# Altium project PROC010B.PrjPcb (part 1 of 3)
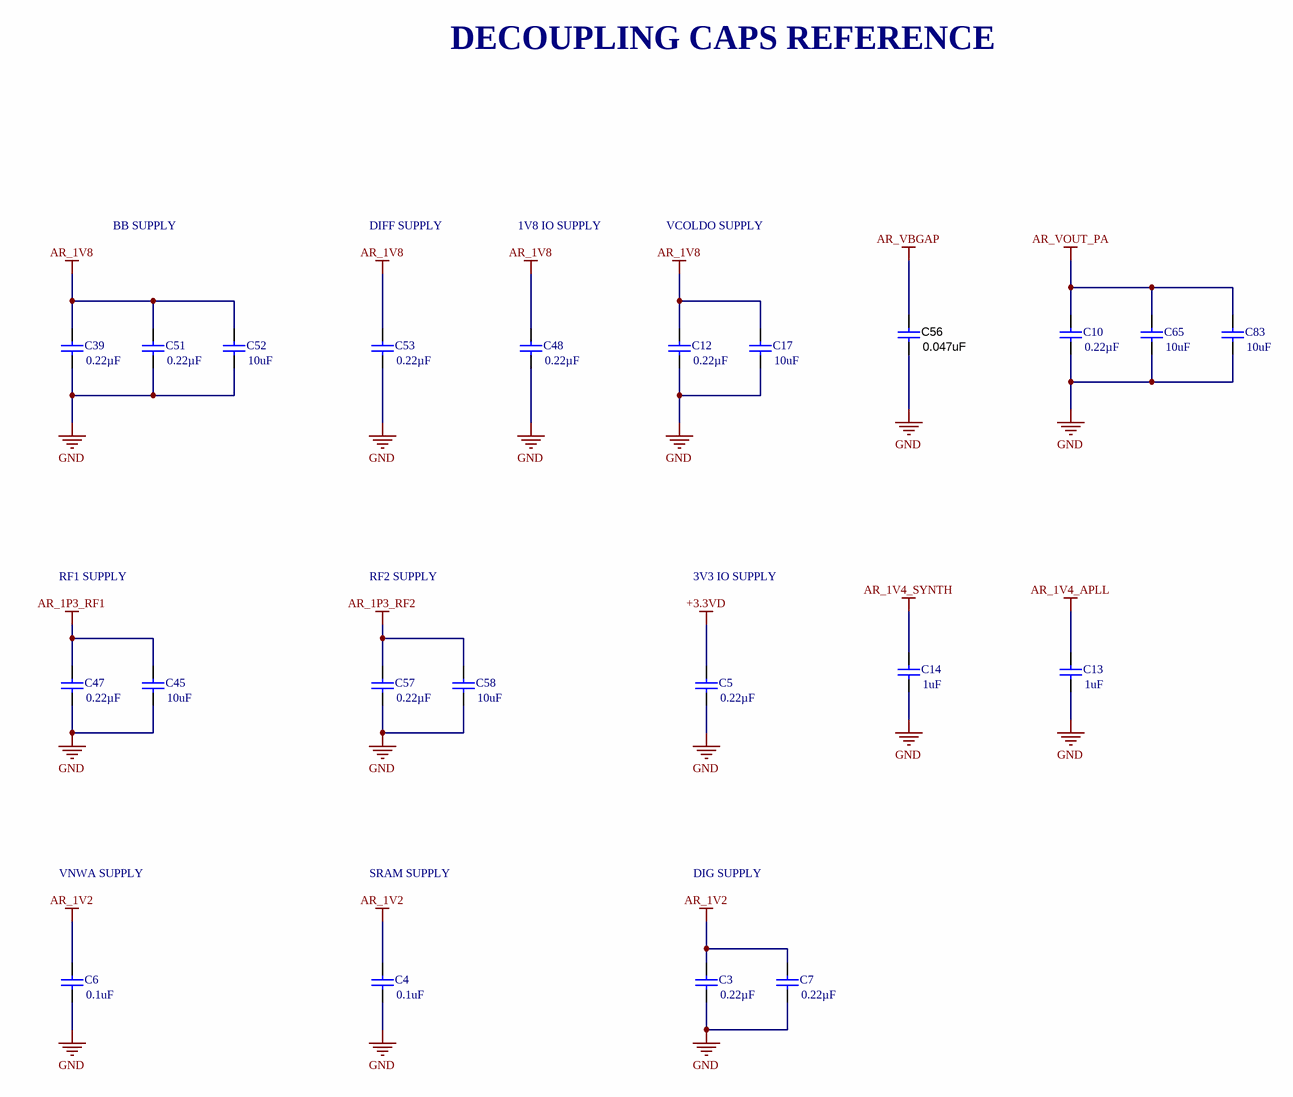
[diagram p0: PROC010C_Decoupling_Caps_Reference.SchDoc]
TID: N/A; TechSupport: http://www.ti.com/support; SCH_Rev: C; PRJ_Title: PROC010; PRJ_Number: PROC010; PRJ_Engineer: Adrian Ozer; PRJ_Customer: Public Release; PCB_Rev: B; PCB_Layout: Tessolve; CopyrightYear: 2018
7 sheets, 159 parts. Net scope: flat (ports and power ports of the same name join across sheets).
Board file: PROC010B_PCB.PcbDoc
Sheets:
  PROC010C_Decoupling_Caps_Reference.SchDoc
  PROC010C_LC_Filtering_Reference.SchDoc
  PROC010C_LP Connector.SchDoc
  PROC010C_XDS110 Interface_1A.SchDoc
  PROC010C_XDS110 Interface_1B.SchDoc
  PROC010C_CAN Interface.SchDoc
  PROC010C_Tempsensor.SchDoc

## Sheet PROC010C_Decoupling_Caps_Reference.SchDoc
size 431 x 279 mm; Date: Not shown in title block; ApprovedBy: Not shown in title block; CheckedBy: Not shown in title block; Author: Not shown in title block; CompanyName: Not shown in title block; DrawnBy: Adrian Ozer; Engineer: Not shown in title block; Organization: Not shown in title block; Address1: Not shown in title block; Address2: Not shown in title block; Address3: Not shown in title block; Address4: Not shown in title block; DocumentNumber: 3; Revision: Use project parameter SCH_Rev; SheetNumber: 3; SheetTotal: 16; PageSetup: Record=PageOptions|CenterHorizontal=True|CenterVertical=True|PrintScale=1.00|XCorrection=1.00|YCorrection=1.00|PrintKind=0|BorderSize=5000000|LeftOffset=0|BottomOffset=0|Orientation=2|PaperLength=1000|PaperWidth=1000|Scale=100|PaperSource=15|PrintQuality=600|MediaType=1|DitherType=10|PaperKind=Letter|PrintScaleMode=1; CurrentTime: Not shown in title block; CurrentDate: Not shown in title block; Time: Not shown in title block; DocumentFullPathAndName: Not shown in title block; DocumentName: Not shown in title block; ModifiedDate: Not shown in title block; ImagePath: Not shown in title block

### Parts
C3  ValueDisplayed: 0.22µF  [0402L]  (hidden comment: GCM155R71C224KE02D)
C4  ValueDisplayed: 0.1uF  [0402L]  (hidden comment: GCM155R71C104KA55D)
C5  ValueDisplayed: 0.22µF  [0402L]  (hidden comment: GCM155R71C224KE02D)
C6  ValueDisplayed: 0.1uF  [0402]  (hidden comment: GCM155R71C104KA55D)
C7  ValueDisplayed: 0.22µF  [0402L]  (hidden comment: GCM155R71C224KE02D)
C10  ValueDisplayed: 0.22µF  [0402]  (hidden comment: GCM155R71C224KE02D)
C12  ValueDisplayed: 0.22µF  [0402]  (hidden comment: GCM155R71C224KE02D)
C13  ValueDisplayed: 1uF  [0603]  (hidden comment: GCM188R71C105KA64D)
C14  ValueDisplayed: 1uF  [0603]  (hidden comment: GCM188R71C105KA64D)
C17  ValueDisplayed: 10uF  [0805_HV]  (hidden comment: GCM21BR71A106KE22L)
C39  ValueDisplayed: 0.22µF  [0402L]  (hidden comment: GCM155R71C224KE02D)
C45  ValueDisplayed: 10uF  [0805_HV1]  (hidden comment: GCM21BR71A106KE22L)
C47  ValueDisplayed: 0.22µF  [0402L]  (hidden comment: GCM155R71C224KE02D)
C48  ValueDisplayed: 0.22µF  [0402]  (hidden comment: GCM155R71C224KE02D)
C51  ValueDisplayed: 0.22µF  [0402]  (hidden comment: GCM155R71C224KE02D)
C52  ValueDisplayed: 10uF  [0805_HV]  (hidden comment: GCM21BR71A106KE22L)
C53  ValueDisplayed: 0.22µF  [0402]  (hidden comment: GCM155R71C224KE02D)
C56  ValueDisplayed: 0.047uF  [0402]  (hidden comment: CGA2B3X7R1H473K050BB)
C57  ValueDisplayed: 0.22µF  [0402]  (hidden comment: GCM155R71C224KE02D)
C58  ValueDisplayed: 10uF  [0805]  (hidden comment: GCM21BR71A106KE22L)
C65  ValueDisplayed: 10uF  [0805_HV]  (hidden comment: GCM21BR71A106KE22L)
C83  ValueDisplayed: 10uF  [0805_HV]  (hidden comment: GCM21BR71A106KE22L)

### Nets
+3.3VD: C5.1
AR_1P3_RF1: C45.1 C47.1
AR_1P3_RF2: C57.1 C58.1
AR_1V2: C3.1 C4.1 C6.1 C7.1
AR_1V4_APLL: C13.1
AR_1V4_SYNTH: C14.1
AR_1V8: C12.1 C17.1 C39.1 C48.1 C51.1 C52.1 C53.1
AR_VBGAP: C56.1
AR_VOUT_PA: C10.1 C65.1 C83.1
GND: C3.2 C4.2 C5.2 C6.2 C7.2 C10.2 C12.2 C13.2 C14.2 C17.2 C39.2 C45.2 C47.2 C48.2 C51.2 C52.2 C53.2 C56.2 C57.2 C58.2 C65.2 C83.2

### Notes on the sheet
- DECOUPLING CAPS REFERENCE
- BB SUPPLY
- DIFF SUPPLY
- 1V8 IO SUPPLY
- VCOLDO SUPPLY
- RF1 SUPPLY
- RF2 SUPPLY
- 3V3 IO SUPPLY
- VNWA SUPPLY
- SRAM SUPPLY
- DIG SUPPLY
- Drawn By:
- SVN Rev:
- Number:
- TID #:
- Orderable:
- Rev:
- Sheet Title:
- File:
- Project Title:
- Designed for:
- Assembly Variant:
- Mod. Date:
- Sheet:
- Size:
- of
- B
- http://www.ti.com
- Texas Instruments and/or its licensors do not warrant the accuracy or completeness of this specification or any information contained therein. Texas Instruments and/or its licensors do not warrant that this design will meet the specifications, will be suitable for your application or fit for any particular purpose, or will operate in an implementation. Texas Instruments and/or its licensors do not warrant that the design is production worthy. You should completely validate and test your design implementation to confirm the system functionality for your application.
- Engineer:
- Contact:
- © Texas Instruments

### Library data of the parts
C3 C5 C7 C39 C47 = CMP-0078265-1: CAP, CERM, 0.22 µF, 16 V,+/- 10%, X7R, AEC-Q200 Grade 1, 0402; Manufacturer: MuRata; TaMin_C: -55°C; Polarized: N; SizeAreaWB_mm2: 3; U/M: EA; Value: 0.22uF; TaMax_C: 125°C; SizeZ_mm: 0.6; SizeX_mm: 1; SizeY_mm: 0.5; Cap_Case: 0402; Value2: 16V; CompType: Capacitor; AEC Qualified: Y; Cap_F: 220nF; AEC Category: Q200; ComponentLink1URL: http://psearch.en.murata.com/capacitor/product/GCM155R71C224KE02%23.pdf; Supplier Part Number 2: 81-GCM155R71C224KE2D; Supplier 2: Mouser; TempCo: X7R; RoHS: Y; MountType: SMT; Supplier 1: Digi-Key; PackageReference: 0402; Tolerance_%: 10%; SizeArea_mm2: 0.5; PartNumber: GCM155R71C224KE02D; VDC_V: 16V; ComponentLink1Description: Datasheet link; AEC Grade: 1; Supplier Part Number 1: 490-10671-1-ND; Technology: Ceramic
C4 = CMP-0006351-2: CAP, CERM, 0.1 uF, 16 V, +/- 10%, X7R, 0402; Manufacturer: MuRata; TaMin_C: -55°C; Polarized: N; SizeAreaWB_mm2: 3; Value1: Unknown; U/M: EA; Value: 0.1uF; TaMax_C: 125°C; SizeZ_mm: 0.6; SizeX_mm: 1; SizeY_mm: 0.5; Cap_Case: 0402; Value2: 16V; CompType: Capacitor; Cap_F: 100nF; AEC Category: Q200; Publisher: Texas Instruments; TempCo: X7R; Published: 2008-06-19; RoHS: Y; MountType: SMT; Supplier 1: Digi-Key; PackageReference: 0402; Tolerance_%: 10%; SizeArea_mm2: 0.5; LatestRevisionDate: 2017-03-09; PartNumber: GCM155R71C104KA55D; AEC Qualified: ?; VDC_V: 16V; ComponentLink1Description: Datasheet link; Supplier Part Number 1: 490-4759-2-ND; Technology: Ceramic; ComponentLink1URL: http://psearch.murata.com/capacitor/product/GCM155R71C104KA55%23.pdf
C6 = CMP-0006351-2: CAP, CERM, 0.1 uF, 16 V, +/- 10%, X7R, 0402; Manufacturer: MuRata; TaMin_C: -55°C; Polarized: N; SizeAreaWB_mm2: 3; Value1: Unknown; U/M: EA; Value: 0.1uF; TaMax_C: 125°C; SizeZ_mm: 0.6; SizeX_mm: 1; SizeY_mm: 0.5; Value2: 16V; Cap_F: 100nF; AEC Category: Q200; Publisher: Texas Instruments; TempCo: X7R; Published: 2008-06-19; RoHS: Y; MountType: SMT; Supplier 1: Digi-Key; PackageReference: 0402; Tolerance_%: 10%; Cap_Case: 0402; SizeArea_mm2: 0.5; CompType: Capacitor; LatestRevisionDate: 2017-03-09; PartNumber: GCM155R71C104KA55D; AEC Qualified: ?; VDC_V: 16V; ComponentLink1Description: Datasheet link; Supplier Part Number 1: 490-4759-2-ND; Technology: Ceramic; ComponentLink1URL: http://psearch.murata.com/capacitor/product/GCM155R71C104KA55%23.pdf
C10 C12 C48 C51 C53 C57 = CMP-0078265-1: CAP, CERM, 0.22 µF, 16 V,+/- 10%, X7R, AEC-Q200 Grade 1, 0402; Manufacturer: MuRata; TaMin_C: -55°C; Polarized: N; SizeAreaWB_mm2: 3; U/M: EA; Value: 0.22uF; TaMax_C: 125°C; SizeZ_mm: 0.6; SizeX_mm: 1; SizeY_mm: 0.5; Value2: 16V; AEC Qualified: Y; Cap_F: 220nF; AEC Category: Q200; ComponentLink1URL: http://psearch.en.murata.com/capacitor/product/GCM155R71C224KE02%23.pdf; Supplier Part Number 2: 81-GCM155R71C224KE2D; Supplier 2: Mouser; TempCo: X7R; RoHS: Y; MountType: SMT; Supplier 1: Digi-Key; PackageReference: 0402; Tolerance_%: 10%; Cap_Case: 0402; SizeArea_mm2: 0.5; CompType: Capacitor; PartNumber: GCM155R71C224KE02D; VDC_V: 16V; ComponentLink1Description: Datasheet link; AEC Grade: 1; Supplier Part Number 1: 490-10671-1-ND; Technology: Ceramic
C13 C14 = CMP-0007136-5: CAP, CERM, 1 uF, 16 V, +/- 10%, X7R, AEC-Q200 Grade 1, 0603; Manufacturer: MuRata; TaMin_C: -55°C; Polarized: N; SizeAreaWB_mm2: 4.68; Value1: Unknown; U/M: EA; Value: 1uF; TaMax_C: 125°C; SizeZ_mm: 1; SizeX_mm: 1.6; SizeY_mm: 0.8; Value2: 16V; SizeArea_mm2: 1.28; AEC Qualified: Y; Cap_F: 1µF; AEC Category: Q200; Supplier Part Number 2: 81-GCM188R71C105K64D; Publisher: Texas Instruments; Supplier 2: Mouser; TempCo: X7R; Published: 2008-06-19; RoHS: Y; MountType: SMT; Supplier 1: Digi-Key; PackageReference: 0603; Tolerance_%: 10%; Cap_Case: 0603; CompType: Capacitor; LatestRevisionDate: 2017-03-09; PartNumber: GCM188R71C105KA64D; VDC_V: 16V; ComponentLink1Description: Datasheet link; AEC Grade: 1; Supplier Part Number 1: 490-5241-6-ND; Technology: Ceramic; ComponentLink1URL: http://psearch.en.murata.com/capacitor/product/GCM188R71C105KA64%23.pdf
C17 C52 C65 C83 = CMP-0008017-2: CAP, CERM, 10 uF, 10 V, +/- 10%, X7R, 0805; Manufacturer: MuRata; TaMin_C: -55°C; Polarized: N; SizeAreaWB_mm2: 6.75; Value1: Unknown; U/M: EA; Value: 10uF; TaMax_C: 125°C; SizeZ_mm: 1.45; SizeX_mm: 2; SizeY_mm: 1.25; Cap_Case: 0805; Value2: 10V; SizeArea_mm2: 2.5; Cap_F: 10µF; AEC Category: Q200; Supplier Part Number 2: 06AC6014; Publisher: Texas Instruments; Supplier 2: Newark; Supplier Part Number 3: 81-GCM21BR71A106KE2L; TempCo: X7R; Supplier 3: Mouser; Published: 2008-06-19; RoHS: Y; MountType: SMT; Supplier 1: Digi-Key; PackageReference: 0805; Tolerance_%: 10%; CompType: Capacitor; LatestRevisionDate: 2017-03-09; PartNumber: GCM21BR71A106KE22L; AEC Qualified: ?; VDC_V: 10V; ComponentLink1Description: Datasheet link; Supplier Part Number 1: 490-10674-1-ND; Technology: Ceramic; ComponentLink1URL: http://www.murata.com/products/catalog/pdf/c03e.pdf
C45 = CMP-0008017-2: CAP, CERM, 10 uF, 10 V, +/- 10%, X7R, 0805; Manufacturer: MuRata; TaMin_C: -55°C; Polarized: N; SizeAreaWB_mm2: 6.75; Value1: Unknown; U/M: EA; Value: 10uF; TaMax_C: 125°C; SizeZ_mm: 1.45; SizeX_mm: 2; SizeY_mm: 1.25; Cap_Case: 0805; Value2: 10V; SizeArea_mm2: 2.5; CompType: Capacitor; Cap_F: 10µF; AEC Category: Q200; Supplier Part Number 2: 06AC6014; Publisher: Texas Instruments; Supplier 2: Newark; Supplier Part Number 3: 81-GCM21BR71A106KE2L; TempCo: X7R; Supplier 3: Mouser; Published: 2008-06-19; RoHS: Y; MountType: SMT; Supplier 1: Digi-Key; PackageReference: 0805; Tolerance_%: 10%; LatestRevisionDate: 2017-03-09; PartNumber: GCM21BR71A106KE22L; AEC Qualified: ?; VDC_V: 10V; ComponentLink1Description: Datasheet link; Supplier Part Number 1: 490-10674-1-ND; Technology: Ceramic; ComponentLink1URL: http://www.murata.com/products/catalog/pdf/c03e.pdf
C56 = CMP-0006330-2: CAP, CERM, 0.047 uF, 50 V, +/- 10%, X7R, AEC-Q200 Grade 1, 0402; Manufacturer: TDK; TaMin_C: -55°C; ESR_ohm: 0.06407; Polarized: N; SizeAreaWB_mm2: 3; Value1: 0.06407 ohm; U/M: EA; TaMax_C: 125°C; SizeZ_mm: 0.6; SizeX_mm: 1; SizeY_mm: 0.5; Value2: 50V; AEC Qualified: Y; Cap_F: 47nF; IRMS_A: 646.122mA; AEC Category: Q200; Supplier Part Number 2: 810-CGA2B3X7R1H473K050BB; Publisher: Texas Instruments; Supplier 2: Mouser; TempCo: X7R; Published: 2008-06-19; RoHS: Y; MountType: SMT; Value: 0.047uF; Supplier 1: Digi-Key; PackageReference: 0402; Tolerance_%: 10%; Cap_Case: 0402; SizeArea_mm2: 0.5; CompType: Capacitor; LatestRevisionDate: 2017-03-09; PartNumber: CGA2B3X7R1H473K050BB; VDC_V: 50V; ComponentLink1Description: Datasheet link; AEC Grade: 1; Supplier Part Number 1: 445-6897-1-ND; Technology: Ceramic; ComponentLink1URL: https://product.tdk.com/en/search/capacitor/ceramic/mlcc/info?part_no=CGA2B3X7R1H473K050BB
C58 = CMP-0008017-2: CAP, CERM, 10 uF, 10 V, +/- 10%, X7R, 0805; Manufacturer: MuRata; TaMin_C: -55°C; Polarized: N; SizeAreaWB_mm2: 6.75; Value1: Unknown; U/M: EA; Value: 10uF; TaMax_C: 125°C; SizeZ_mm: 1.45; SizeX_mm: 2; SizeY_mm: 1.25; Value2: 10V; SizeArea_mm2: 2.5; CompType: Capacitor; Cap_F: 10µF; AEC Category: Q200; Supplier Part Number 2: 06AC6014; Publisher: Texas Instruments; Supplier 2: Newark; Supplier Part Number 3: 81-GCM21BR71A106KE2L; TempCo: X7R; Supplier 3: Mouser; Published: 2008-06-19; RoHS: Y; MountType: SMT; Supplier 1: Digi-Key; PackageReference: 0805; Tolerance_%: 10%; Cap_Case: 0805; LatestRevisionDate: 2017-03-09; PartNumber: GCM21BR71A106KE22L; AEC Qualified: ?; VDC_V: 10V; ComponentLink1Description: Datasheet link; Supplier Part Number 1: 490-10674-1-ND; Technology: Ceramic; ComponentLink1URL: http://www.murata.com/products/catalog/pdf/c03e.pdf

## Sheet PROC010C_LC_Filtering_Reference.SchDoc
size 431 x 279 mm; Date: Not shown in title block; ApprovedBy: Not shown in title block; CheckedBy: Not shown in title block; Author: Not shown in title block; CompanyName: Not shown in title block; DrawnBy: Adrian Ozer; Engineer: Not shown in title block; Organization: Not shown in title block; Address1: Not shown in title block; Address2: Not shown in title block; Address3: Not shown in title block; Address4: Not shown in title block; DocumentNumber: 5; Revision: Use project parameter SCH_Rev; SheetNumber: 5; SheetTotal: 16; PageSetup: Record=PageOptions|CenterHorizontal=True|CenterVertical=True|PrintScale=1.00|XCorrection=1.00|YCorrection=1.00|PrintKind=0|BorderSize=5000000|LeftOffset=0|BottomOffset=0|Orientation=2|PaperLength=1000|PaperWidth=1000|Scale=100|PaperSource=15|PrintQuality=600|MediaType=1|DitherType=10|PaperKind=Letter|PrintScaleMode=1; CurrentTime: Not shown in title block; CurrentDate: Not shown in title block; Time: Not shown in title block; DocumentFullPathAndName: Not shown in title block; DocumentName: Not shown in title block; ModifiedDate: Not shown in title block; ImagePath: Not shown in title block
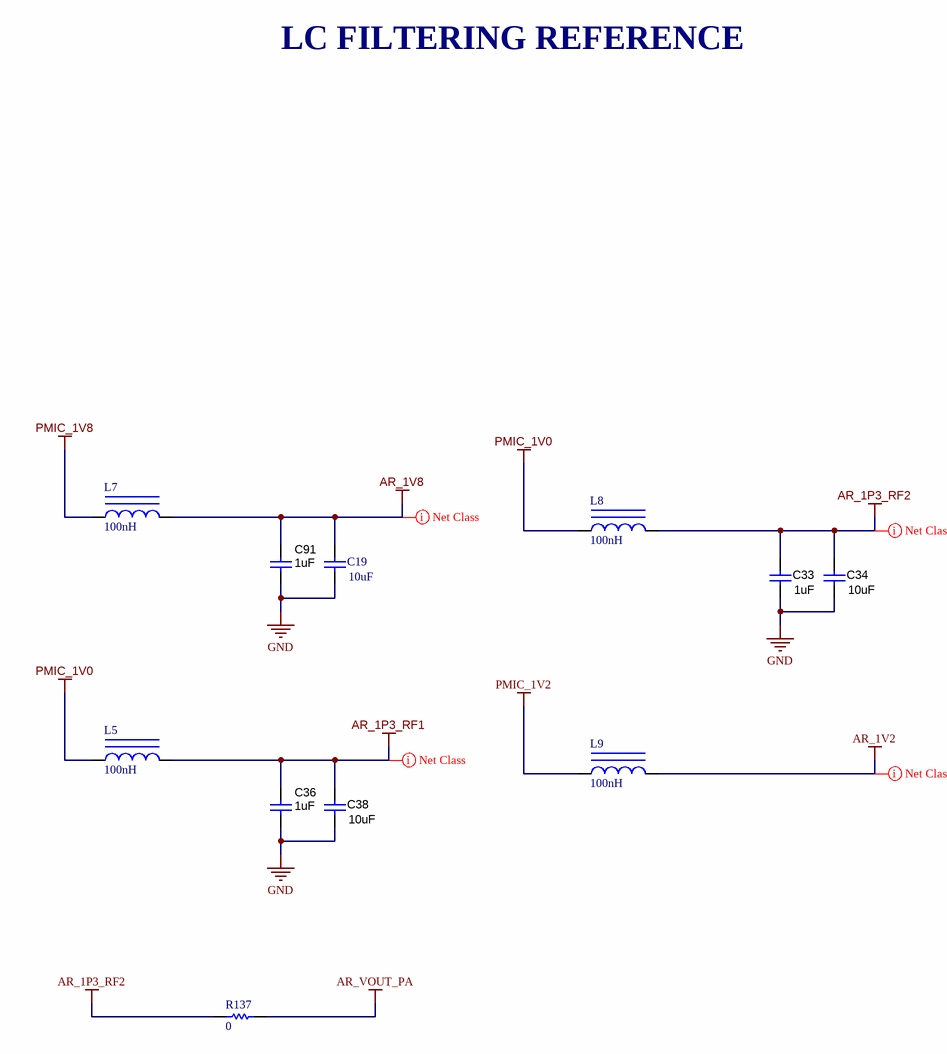
[diagram p1: PROC010C_LC_Filtering_Reference.SchDoc]

### Parts
C19  ValueDisplayed: 10uF  [0805_HV]  (hidden comment: GCM21BR71A106KE22L)
C33  ValueDisplayed: 1uF  [0603]  (hidden comment: GCM188R71C105KA64D)
C34  ValueDisplayed: 10uF  [0805_HV]  (hidden comment: GCM21BR71A106KE22L)
C36  ValueDisplayed: 1uF  [0603]  (hidden comment: GCM188R71C105KA64D)
C38  ValueDisplayed: 10uF  [0805_HV]  (hidden comment: GCM21BR71A106KE22L)
C91  ValueDisplayed: 1uF  [0603]  (hidden comment: GCM188R71C105KA64D)
L5  ValueDisplayed: 100nH  [NLCV32]  (hidden comment: NLCV32T-R10M-EFRD)
L7  ValueDisplayed: 100nH  [NLCV32]  (hidden comment: NLCV32T-R10M-EFRD)
L8  ValueDisplayed: 100nH  [NLCV32]  (hidden comment: NLCV32T-R10M-EFRD)
L9  ValueDisplayed: 100nH  [NLCV32]  (hidden comment: NLCV32T-R10M-EFRD)
R137  ValueDisplayed: 0  [0603]  (hidden comment: MCT06030Z0000ZP500)

### Nets
AR_1P3_RF1: C36.2 C38.2 L5.2
AR_1P3_RF2: C33.2 C34.2 L8.2 R137.1
AR_1V2: L9.2
AR_1V8: C19.1 C91.2 L7.2
AR_VOUT_PA: R137.2
GND: C19.2 C33.1 C34.1 C36.1 C38.1 C91.1
PMIC_1V0: L5.1 L8.1
PMIC_1V2: L9.1
PMIC_1V8: L7.1

### Layout directives
net class PWR: AR_1P3_RF1, AR_1P3_RF2, AR_1V2, AR_1V8

### Notes on the sheet
- LC FILTERING REFERENCE
- Drawn By:
- SVN Rev:
- Number:
- TID #:
- Orderable:
- Rev:
- Sheet Title:
- File:
- Project Title:
- Designed for:
- Assembly Variant:
- Mod. Date:
- Sheet:
- Size:
- of
- B
- http://www.ti.com
- Texas Instruments and/or its licensors do not warrant the accuracy or completeness of this specification or any information contained therein. Texas Instruments and/or its licensors do not warrant that this design will meet the specifications, will be suitable for your application or fit for any particular purpose, or will operate in an implementation. Texas Instruments and/or its licensors do not warrant that the design is production worthy. You should completely validate and test your design implementation to confirm the system functionality for your application.
- Engineer:
- Contact:
- © Texas Instruments

### Library data of the parts
C19 = CMP-0008017-2: as C17 on sheet PROC010C_Decoupling_Caps_Reference; Supplier Part Number 2: 06AC6014; Publisher: Texas Instruments; Supplier 2: Newark; Supplier Part Number 3: 81-GCM21BR71A106KE2L; TempCo: X7R; Supplier 3: Mouser; Published: 2008-06-19; RoHS: Y; MountType: SMT; Supplier 1: Digi-Key; PackageReference: 0805; Tolerance_%: 10%; CompType: Capacitor; LatestRevisionDate: 2017-03-09; PartNumber: GCM21BR71A106KE22L; AEC Qualified: ?; VDC_V: 10V; ComponentLink1Description: Datasheet link; Supplier Part Number 1: 490-10674-1-ND; Technology: Ceramic; ComponentLink1URL: http://www.murata.com/products/catalog/pdf/c03e.pdf
C33 C36 C91 = CMP-0007136-5: as C13 on sheet PROC010C_Decoupling_Caps_Reference; Supplier Part Number 2: 81-GCM188R71C105K64D; Publisher: Texas Instruments; Supplier 2: Mouser; TempCo: X7R; Published: 2008-06-19; RoHS: Y; MountType: SMT; Supplier 1: Digi-Key; PackageReference: 0603; Tolerance_%: 10%; Cap_Case: 0603; CompType: Capacitor; LatestRevisionDate: 2017-03-09; PartNumber: GCM188R71C105KA64D; VDC_V: 16V; ComponentLink1Description: Datasheet link; AEC Grade: 1; Supplier Part Number 1: 490-5241-6-ND; Technology: Ceramic; ComponentLink1URL: http://psearch.en.murata.com/capacitor/product/GCM188R71C105KA64%23.pdf
C34 C38 = CMP-0008017-2: as C45 on sheet PROC010C_Decoupling_Caps_Reference; Supplier Part Number 2: 06AC6014; Publisher: Texas Instruments; Supplier 2: Newark; Supplier Part Number 3: 81-GCM21BR71A106KE2L; TempCo: X7R; Supplier 3: Mouser; Published: 2008-06-19; RoHS: Y; MountType: SMT; Supplier 1: Digi-Key; PackageReference: 0805; Tolerance_%: 10%; LatestRevisionDate: 2017-03-09; PartNumber: GCM21BR71A106KE22L; AEC Qualified: ?; VDC_V: 10V; ComponentLink1Description: Datasheet link; Supplier Part Number 1: 490-10674-1-ND; Technology: Ceramic; ComponentLink1URL: http://www.murata.com/products/catalog/pdf/c03e.pdf
L5 L7-L9 = CMP-0083745-1: Inductor, Wirewound, Ferrite, 100 nH, 2.85 A, 0.024 ohm, AEC-Q200 Grade 1, SMD; Manufacturer: TDK; Isat: 2.85A @ 10% inductance drop; Irms: 2.85A @ 40C rise; SizeAreaWB_mm2: 13.44; DCR_ohm: 0.024; Value: 100nH; Imax_A: 2.85A; SizeZ_mm: 2.5; SizeX_mm: 3.2; SizeY_mm: 2.2; SizeArea_mm2: 7.04; AEC Qualified: Y; AEC Grade: 1; AEC Category: Q200; ComponentLink1URL: https://product.tdk.com/info/en/catalog/datasheets/inductor_automotive_decoupling_nlcv32-efrd_en.pdf; RoHS: Y; Value1: 0.024 ohm; Material: Ferrite; MountType: SMT; PackageReference: 3.2x2.2x2.5mm; Value2: 2.85A; CompType: Inductor; Ind_H: 100nH; PartNumber: NLCV32T-R10M-EFRD; ComponentLink1Description: Datasheet link; Technology: Wirewound
R137 = CMP-0025884-3: RES, 0, 5%, 0.125 W, 0603; Manufacturer: Vishay/Beyschlag; Power_W: 125mW; TempCo: ppm/C; Value_Code: 0000; U/M: EA; Value: 0; EIA_Code: E24; SizeX_mm: 1.6; SizeY_mm: 0.8; SizeZ_mm: 1; Value2: 0.125W; SizeArea_mm2: 1.28; CompType: Resistor; AEC Qualified: N; AEC Category: Q200; Supplier Part Number 2: 96Y9454; Publisher: Texas Instruments; Supplier 2: Newark; Supplier Part Number 3: 594-MCT06030Z0000ZP5; Supplier 3: Mouser; Published: 2008-06-26; RoHS: Y; Value1: 5%; MountType: SMT; Supplier 1: Digi-Key; PackageReference: 0603; Tolerance_%: 5%; Res_ohm: 0; LatestRevisionDate: 2017-03-09; PartNumber: MCT06030Z0000ZP500; ComponentLink1Description: Datasheet link; AEC Grade: N/A; Supplier Part Number 1: MCT0603-0.0-ZZCT-ND; Technology: Thin Film; ComponentLink1URL: http://www.vishay.com/docs/28705/mcx0x0xpro.pdf

## Sheet PROC010C_LP Connector.SchDoc: LP Connector
size 431 x 279 mm; Date: Not shown in title block; ApprovedBy: Not shown in title block; CheckedBy: Not shown in title block; Author: Not shown in title block; CompanyName: Not shown in title block; DrawnBy: Adrian Ozer; Engineer: Not shown in title block; Organization: Not shown in title block; Address1: Not shown in title block; Address2: Not shown in title block; Address3: Not shown in title block; Address4: Not shown in title block; DocumentNumber: 11; Revision: Use project parameter SCH_Rev; SheetNumber: 11; SheetTotal: 16; PageSetup: Record=PageOptions|CenterHorizontal=True|CenterVertical=True|PrintScale=1.00|XCorrection=1.00|YCorrection=1.00|PrintKind=0|BorderSize=5000000|LeftOffset=0|BottomOffset=0|Orientation=2|PaperLength=1000|PaperWidth=1000|Scale=100|PaperSource=15|PrintQuality=600|MediaType=1|DitherType=10|PaperKind=Letter|PrintScaleMode=1; CurrentTime: Not shown in title block; CurrentDate: Not shown in title block; Time: Not shown in title block; DocumentFullPathAndName: Not shown in title block; DocumentName: Not shown in title block; ModifiedDate: Not shown in title block; ImagePath: Not shown in title block
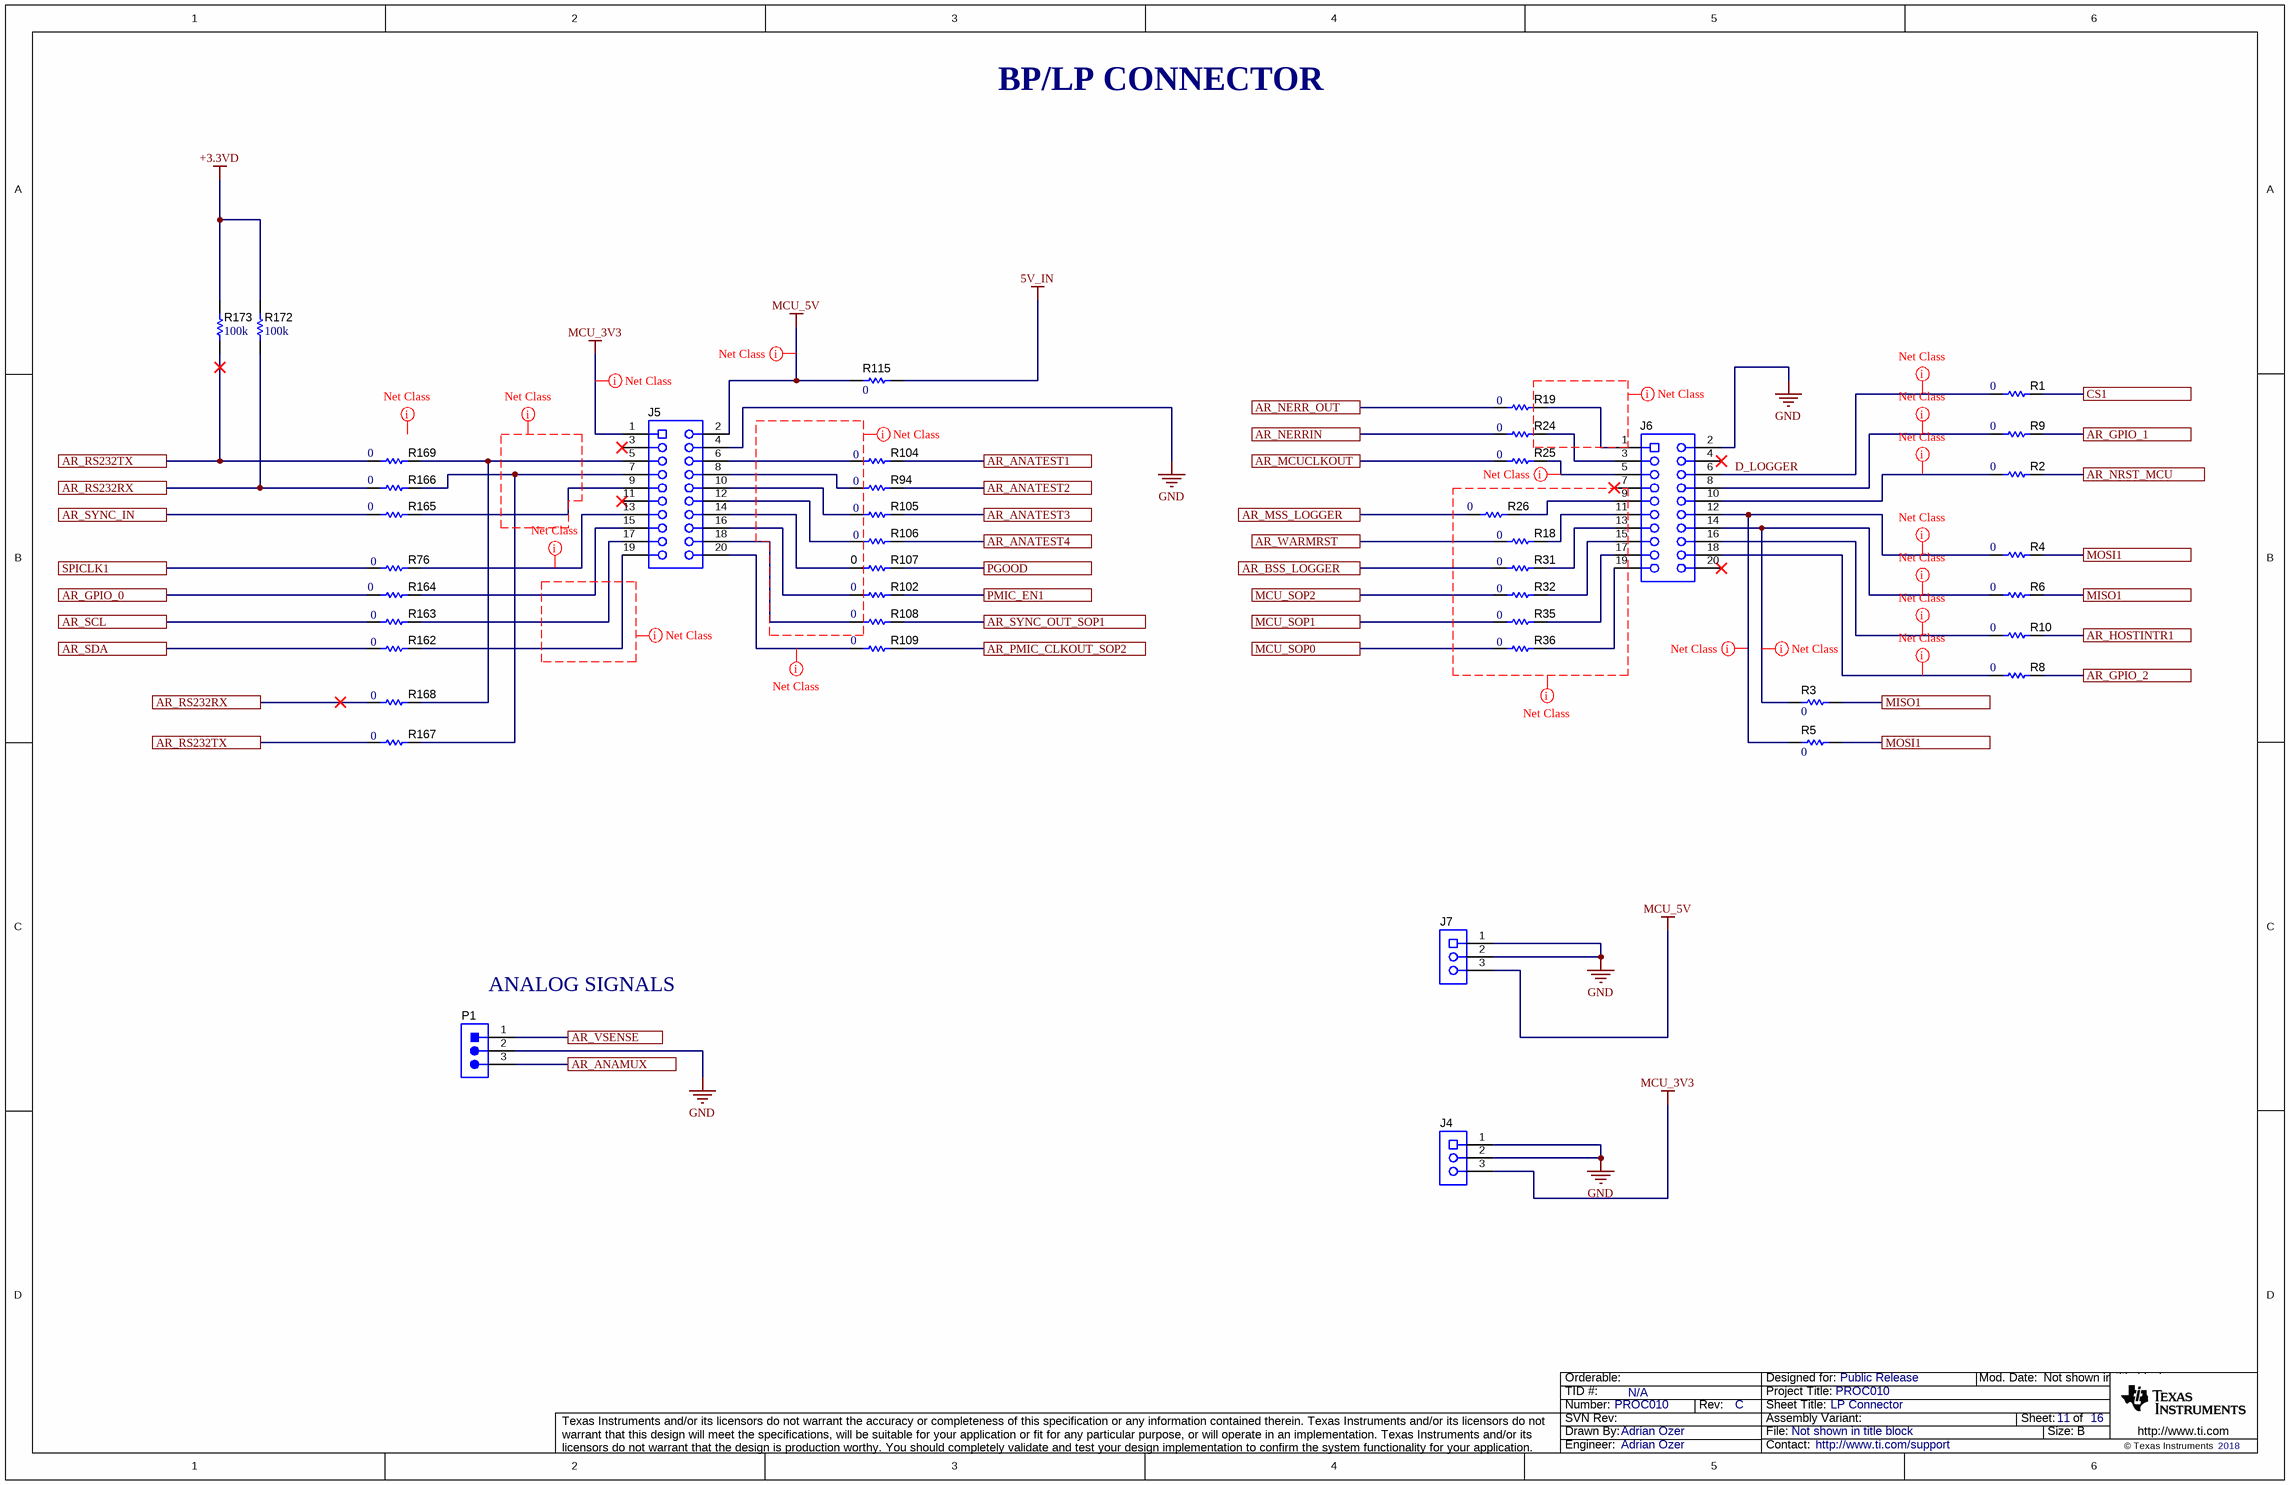
[diagram p2: PROC010C_LP Connector.SchDoc]

### Parts
J4  SSM-103-S-SV  [Samtec_SSM-103-x-SV]  (value not drawn)
J5  SSM-110-S-DV  [Samtec_SSM-110-x-DV]  (value not drawn)
J6  SSM-110-S-DV  [Samtec_SSM-110-x-DV]  (value not drawn)
J7  SSM-103-S-SV  [Samtec_SSM-103-x-SV]  (value not drawn)
P1  TSW-103-07-T-S  [Samtec_TSW-103-07-T-S]  (value not drawn)
R1  ValueDisplayed: 0  [0201_Silk]  (hidden comment: CRCW02010000Z0ED)
R2  ValueDisplayed: 0  [0201_Silk]  (hidden comment: CRCW02010000Z0ED)
R3  ValueDisplayed: 0  [0201_Silk]  (hidden comment: CRCW02010000Z0ED)
R4  ValueDisplayed: 0  [0201_Silk]  (hidden comment: CRCW02010000Z0ED)
R5  ValueDisplayed: 0  [0201_Silk]  (hidden comment: CRCW02010000Z0ED)
R6  ValueDisplayed: 0  [0201_Silk]  (hidden comment: CRCW02010000Z0ED)
R8  ValueDisplayed: 0  [0201_Silk]  (hidden comment: CRCW02010000Z0ED)
R9  ValueDisplayed: 0  [0201_Silk]  (hidden comment: CRCW02010000Z0ED)
R10  ValueDisplayed: 0  [0201_Silk]  (hidden comment: CRCW02010000Z0ED)
R18  ValueDisplayed: 0  [0201_Silk]  (hidden comment: CRCW02010000Z0ED)
R19  ValueDisplayed: 0  [0201_Silk]  (hidden comment: CRCW02010000Z0ED)
R24  ValueDisplayed: 0  [0201_Silk]  (hidden comment: CRCW02010000Z0ED)
R25  ValueDisplayed: 0  [0201_Silk]  (hidden comment: CRCW02010000Z0ED)
R26  ValueDisplayed: 0  [0201_Silk]  (hidden comment: CRCW02010000Z0ED)
R31  ValueDisplayed: 0  [0201_Silk]  (hidden comment: CRCW02010000Z0ED)
R32  ValueDisplayed: 0  [0201_Silk]  (hidden comment: CRCW02010000Z0ED)
R35  ValueDisplayed: 0  [0201_Silk]  (hidden comment: CRCW02010000Z0ED)
R36  ValueDisplayed: 0  [0201_Silk]  (hidden comment: CRCW02010000Z0ED)
R76  ValueDisplayed: 0  [0201_Silk]  (hidden comment: CRCW02010000Z0ED)
R94  ValueDisplayed: 0  [0201_Silk]  (hidden comment: CRCW02010000Z0ED)
R102  ValueDisplayed: 0  [0201_Silk]  (hidden comment: CRCW02010000Z0ED)
R104  ValueDisplayed: 0  [0201_Silk]  (hidden comment: CRCW02010000Z0ED)
R105  ValueDisplayed: 0  [0201_Silk]  (hidden comment: CRCW02010000Z0ED)
R106  ValueDisplayed: 0  [0201_Silk]  (hidden comment: CRCW02010000Z0ED)
R107  ValueDisplayed: 0  [0402L]  (hidden comment: ERJ-2GE0R00X)
R108  ValueDisplayed: 0  [0201_Silk]  (hidden comment: CRCW02010000Z0ED)
R109  ValueDisplayed: 0  [0201_Silk]  (hidden comment: CRCW02010000Z0ED)
R115  ValueDisplayed: 0  [2010]  (hidden comment: CRCW20100000Z0EF)
R162  ValueDisplayed: 0  [0201_Silk]  (hidden comment: CRCW02010000Z0ED)
R163  ValueDisplayed: 0  [0201_Silk]  (hidden comment: CRCW02010000Z0ED)
R164  ValueDisplayed: 0  [0201_Silk]  (hidden comment: CRCW02010000Z0ED)
R165  ValueDisplayed: 0  [0201_Silk]  (hidden comment: CRCW02010000Z0ED)
R166  ValueDisplayed: 0  [0201_Silk]  (hidden comment: CRCW02010000Z0ED)
R167  ValueDisplayed: 0  [0201_Silk]  (hidden comment: CRCW02010000Z0ED)
R168  ValueDisplayed: 0  [0201_Silk]  (hidden comment: CRCW02010000Z0ED)
R169  ValueDisplayed: 0  [0201_Silk]  (hidden comment: CRCW02010000Z0ED)
R172  ValueDisplayed: 100k  [0402L]  (hidden comment: CRCW0402100KFKED)
R173  ValueDisplayed: 100k  [0402L]  (hidden comment: CRCW0402100KFKED)

### Ports
AR_ANAMUX, AR_ANATEST1, AR_ANATEST2, AR_ANATEST3, AR_ANATEST4, AR_BSS_LOGGER, AR_GPIO_0, AR_GPIO_1, AR_GPIO_2, AR_HOSTINTR1, AR_MCUCLKOUT, AR_MSS_LOGGER, AR_NERR_OUT, AR_NERRIN, AR_NRST_MCU, AR_PMIC_CLKOUT_SOP2, AR_RS232RX, AR_RS232TX, AR_SCL, AR_SDA, AR_SYNC_IN, AR_SYNC_OUT_SOP1, AR_VSENSE, AR_WARMRST, CS1, MCU_SOP0, MCU_SOP1, MCU_SOP2, MISO1, MOSI1, PGOOD, PMIC_EN1, SPICLK1

### Nets
5V_IN: R115.2
+3.3VD: R172.2 R173.2
GND: J4.1 J4.2 J5.4 J6.2 J7.1 J7.2 P1.2
MCU_3V3: J4.3 J5.1
MCU_5V: J5.2 J7.3 R115.1
AR_ANAMUX: P1.3 ; port AR_ANAMUX
AR_ANATEST1: R104.2 ; port AR_ANATEST1
AR_ANATEST2: R94.2 ; port AR_ANATEST2
AR_ANATEST3: R105.2 ; port AR_ANATEST3
AR_ANATEST4: R106.2 ; port AR_ANATEST4
AR_BSS_LOGGER: R31.1 ; port AR_BSS_LOGGER
AR_GPIO_0: R164.1 ; port AR_GPIO_0
AR_GPIO_1: R9.2 ; port AR_GPIO_1
AR_GPIO_2: R8.2 ; port AR_GPIO_2
AR_HOSTINTR1: R10.2 ; port AR_HOSTINTR1
AR_MCUCLKOUT: R25.1 ; port AR_MCUCLKOUT
AR_MSS_LOGGER: R26.1 ; port AR_MSS_LOGGER
AR_NERR_OUT: R19.1 ; port AR_NERR_OUT
AR_NERRIN: R24.1 ; port AR_NERRIN
AR_NRST_MCU: R2.2 ; port AR_NRST_MCU
AR_PMIC_CLKOUT_SOP2: R109.2 ; port AR_PMIC_CLKOUT_SOP2
AR_RS232RX: R166.1 R168.1 R172.1 ; port AR_RS232RX
AR_RS232TX: R167.1 R169.1 R173.1 ; port AR_RS232TX
AR_SCL: R163.1 ; port AR_SCL
AR_SDA: R162.1 ; port AR_SDA
AR_SYNC_IN: R165.1 ; port AR_SYNC_IN
AR_SYNC_OUT_SOP1: R108.2 ; port AR_SYNC_OUT_SOP1
AR_VSENSE: P1.1 ; port AR_VSENSE
AR_WARMRST: R18.1 ; port AR_WARMRST
CS1: R1.2 ; port CS1
D_LOGGER: J6.6 R1.1
MCU_SOP0: R36.1 ; port MCU_SOP0
MCU_SOP1: R35.1 ; port MCU_SOP1
MCU_SOP2: R32.1 ; port MCU_SOP2
MISO1: R3.2 R6.2 ; port MISO1
MOSI1: R4.2 R5.2 ; port MOSI1
PGOOD: R107.2 ; port PGOOD
PMIC_EN1: R102.2 ; port PMIC_EN1
SPICLK1: R76.1 ; port SPICLK1
NetJ5_5: J5.5 R168.2 R169.2
NetJ5_6: J5.6 R104.1
NetJ5_7: J5.7 R166.2 R167.2
NetJ5_8: J5.8 R94.1
NetJ5_9: J5.9 R165.2
NetJ5_10: J5.10 R105.1
NetJ5_12: J5.12 R106.1
NetJ5_13: J5.13 R76.2
NetJ5_14: J5.14 R107.1
NetJ5_15: J5.15 R164.2
NetJ5_16: J5.16 R102.1
NetJ5_17: J5.17 R163.2
NetJ5_18: J5.18 R108.1
NetJ5_19: J5.19 R162.2
NetJ5_20: J5.20 R109.1
NetJ6_1: J6.1 R19.2
NetJ6_3: J6.3 R24.2
NetJ6_5: J6.5 R25.2
NetJ6_8: J6.8 R9.1
NetJ6_9: J6.9 R26.2
NetJ6_10: J6.10 R2.1
NetJ6_11: J6.11 R18.2
NetJ6_12: J6.12 R4.1 R5.1
NetJ6_13: J6.13 R31.2
NetJ6_14: J6.14 R3.1 R6.1
NetJ6_15: J6.15 R32.2
NetJ6_16: J6.16 R10.1
NetJ6_17: J6.17 R35.2
NetJ6_18: J6.18 R8.1
NetJ6_19: J6.19 R36.2

Not connected (* = marked no-connect by the designer): J5 3* 11*; J6 4* 7* 20*

### Layout directives
net class GENERAL: (no net found under the mark), NetJ6_8, NetJ6_10, NetJ6_18
net class CLK: NetJ5_20, NetJ6_5
net class PWR: MCU_3V3, MCU_5V
net class SPI: D_LOGGER, NetJ5_13, NetJ6_12, NetJ6_14, NetJ6_16

### Notes on the sheet
- BP/LP CONNECTOR
- (near P1) ANALOG SIGNALS
- Drawn By:
- SVN Rev:
- Number:
- TID #:
- Orderable:
- Rev:
- Sheet Title:
- File:
- Project Title:
- Designed for:
- Assembly Variant:
- Mod. Date:
- Sheet:
- Size:
- of
- B
- http://www.ti.com
- Texas Instruments and/or its licensors do not warrant the accuracy or completeness of this specification or any information contained therein. Texas Instruments and/or its licensors do not warrant that this design will meet the specifications, will be suitable for your application or fit for any particular purpose, or will operate in an implementation. Texas Instruments and/or its licensors do not warrant that the design is production worthy. You should completely validate and test your design implementation to confirm the system functionality for your application.
- Engineer:
- Contact:
- © Texas Instruments

### Library data of the parts
J4 J7 = CMP-0078183-1: Receptacle, 2.54mm, 3x1, Gold with Tin tail, SMT; Manufacturer: Samtec; Pitch_mm: 2.54; Gender: Female; Cert_CSA: Y; Voltage_V: 405V; Current_A: 5.2A; Row_Count: 1; CompType: Socket Strip; ComponentLink1Description: Datasheet URL; RoHS: Y; Supplier 1: Digi-Key; Cert_UL: Y; Orientation: Vertical; PackageReference: Receptacle, 2.54mm, 3x1, SMT; Color: Black; PartNumber: SSM-103-S-SV; PinCount: 3; Supplier Part Number 2: 11P7855; ContactFinish: Gold; Supplier 2: Newark; ComponentLink1URL: http://suddendocs.samtec.com/catalog_english/ssm_sm.pdf; MountType: SMT; Supplier Part Number 1: SAM1152-03-ND
J5 J6 = CMP-0078182-1: Receptacle, 2.54mm, 10x2, Gold with Tin tail, SMT; Manufacturer: Samtec; Pitch_mm: 2.54; Gender: Female; Cert_CSA: Y; Voltage_V: 405V; Current_A: 5.2A; Row_Count: 2; CompType: Socket Strip; ComponentLink1Description: Datasheet URL; RoHS: Y; Supplier 1: Digi-Key; Cert_UL: Y; Orientation: Vertical; PackageReference: Receptacle, 2.54mm, 10x2, SMT; Color: Black; PartNumber: SSM-110-S-DV; PinCount: 20; Supplier Part Number 2: 66H7361; ContactFinish: Gold; Supplier 2: Newark; RowSpacing_mm: 2.54; ComponentLink1URL: http://suddendocs.samtec.com/catalog_english/ssm_sm.pdf; MountType: SMT; Supplier Part Number 1: SAM1150-10-ND
P1 = CMP-0075530-2: Header, 2.54 mm, 3x1, Tin, TH; Manufacturer: Samtec; Pitch_mm: 2.54; Cert_VDE: N; Gender: Male; Cert_CSA: Y; Voltage_V: 550V; Green_REACh: Passed; Current_A: 6.3A; Green_Lifecycle: Active; Row_Count: 1; ComponentLink1Description: Datasheet URL; RoHS: Y; Supplier Part Number 3: 2035682; Supplier 1: Digi-Key; Cert_UL: Y; Orientation: Vertical; Green_EU RoHS: Passed; PackageReference: Header, 2.54 mm, 3x1, TH; Color: Black; PartNumber: TSW-103-07-T-S; PinCount: 3; Supplier Part Number 2: 12P1325; ContactFinish: Tin; Supplier 2: Newark; Cert_CULUS: N; Shrouded: N; ClassName: Header; ComponentLink1URL: http://www.samtec.com/ftppub/cpdf/TSW-XXX-XX-XXX-X-XX-XXX-MKT.pdf; CompType: Header; MountType: TH; Supplier Part Number 1: SAM1035-03-ND; Supplier 3: Farnell; Green_EU RoHS-2: Passed
R1-R6 R8-R10 R18 R19 R24-R26 R31 R32 R35 R36 R94 R102 R105 R106 R108 R109 R162-R169 = CMP-0027008-4: RES, 0, 5%, 0.05 W, 0201; Manufacturer: Vishay-Dale; Power_W: 50mW; TempCo: ppm/C; Value_Code: 0000; Value: 0; EIA_Code: E24; SizeX_mm: 0.6; SizeY_mm: 0.3; SizeZ_mm: 0.26; Value2: 0.05W; SizeArea_mm2: 0.18; AEC Qualified: N; AEC Category: Q200; RoHS: E; Value1: 5%; MountType: SMT; Supplier 1: Newark; PackageReference: 0201; Tolerance_%: 5%; Res_ohm: 0; CompType: Resistor; PartNumber: CRCW02010000Z0ED; ComponentLink1Description: Datasheet link; AEC Grade: N/A; Supplier Part Number 1: 72M6743; Technology: Thick Film; ComponentLink1URL: http://www.vishay.com/docs/20052/crcw0201e3.pdf
R76 R104 = CMP-0027008-4: RES, 0, 5%, 0.05 W, 0201; Manufacturer: Vishay-Dale; Power_W: 50mW; TempCo: ppm/C; Value_Code: 0000; Value: 0; EIA_Code: E24; SizeX_mm: 0.6; SizeY_mm: 0.3; SizeZ_mm: 0.26; Value2: 0.05W; SizeArea_mm2: 0.18; CompType: Resistor; AEC Qualified: N; AEC Category: Q200; RoHS: E; Value1: 5%; MountType: SMT; Supplier 1: Newark; PackageReference: 0201; Tolerance_%: 5%; Res_ohm: 0; PartNumber: CRCW02010000Z0ED; ComponentLink1Description: Datasheet link; AEC Grade: N/A; Supplier Part Number 1: 72M6743; Technology: Thick Film; ComponentLink1URL: http://www.vishay.com/docs/20052/crcw0201e3.pdf
R107 = CMP-0026992-2: RES, 0, 5%, 0.063 W, 0402; Manufacturer: Panasonic; Power_W: 63mW; TempCo: 600 ppm/C; Value_Code: 0000; U/M: EA; Value: 0; EIA_Code: E24; SizeX_mm: 1; SizeY_mm: 0.5; SizeZ_mm: 0.6; Value2: 0.063W; VDC_V: 50V; AEC Category: Q200; Supplier Part Number 2: 65T8307; Publisher: Texas Instruments; Supplier 2: Newark; Supplier Part Number 3: 667-ERJ-2GE0R00X; Supplier 3: Mouser; Published: 2008-06-26; RoHS: Y; Value1: 5%; MountType: SMT; Supplier 1: Digi-Key; PackageReference: 0402; Tolerance_%: 5%; Res_ohm: 0; SizeArea_mm2: 0.5; CompType: Resistor; LatestRevisionDate: 2017-03-09; PartNumber: ERJ-2GE0R00X; AEC Qualified: ?; ComponentLink1Description: Datasheet link; Supplier Part Number 1: P0.0JCT-ND; Technology: Thick Film; ComponentLink1URL: http://www.panasonic.com/industrial/components/pdf/AOA0000CE1.pdf
R115 = CMP-0016044-3: RES, 0, 5%, 0.75 W, AEC-Q200 Grade 0, 2010; Manufacturer: Vishay-Dale; Power_W: 750mW; TempCo: ppm/C; Value_Code: 0000; Value: 0; EIA_Code: E24; SizeX_mm: 5; SizeY_mm: 2.5; SizeZ_mm: 1.66; Value2: 0.75W; SizeArea_mm2: 12.5; AEC Qualified: Y; AEC Category: Q200; RoHS: E; Value1: 5%; MountType: SMT; Supplier 1: Digi-Key; PackageReference: 2010; Tolerance_%: 5%; Res_ohm: 0; CompType: Resistor; PartNumber: CRCW20100000Z0EF; ComponentLink1Description: Datasheet link; AEC Grade: 0; Supplier Part Number 1: 541-0.0WCT-ND; Technology: Thick Film; ComponentLink1URL: http://www.vishay.com/docs/20035/dcrcwe3.pdf
R172 R173 = CMP-0025950-3: RES, 100 k, 1%, 0.063 W, AEC-Q200 Grade 0, 0402; Manufacturer: Vishay-Dale; Power_W: 63mW; TempCo: 100 ppm/C; Value: 100k; EIA_Code: E96; SizeX_mm: 1; SizeY_mm: 0.5; SizeZ_mm: 0.6; Value2: 0.063W; AEC Qualified: Y; VDC_V: 50V; AEC Category: Q200; AEC Grade: 0; Supplier Part Number 2: 52K6607; Supplier 2: Newark; Supplier Part Number 3: 71-CRCW0402-100K-E3; Supplier 3: Mouser; Value_Code: 100k; RoHS: E; Value1: 1%; MountType: SMT; Supplier 1: Digi-Key; PackageReference: 0402; Tolerance_%: 1%; Res_ohm: 100k; SizeArea_mm2: 0.5; CompType: Resistor; PartNumber: CRCW0402100KFKED; ComponentLink1Description: Datasheet link; Supplier Part Number 1: 541-100KLCT-ND; Technology: Thick Film; ComponentLink1URL: http://www.vishay.com/docs/20035/dcrcwe3.pdf